# Altium schematic sheet MCU.SchDoc
size A4
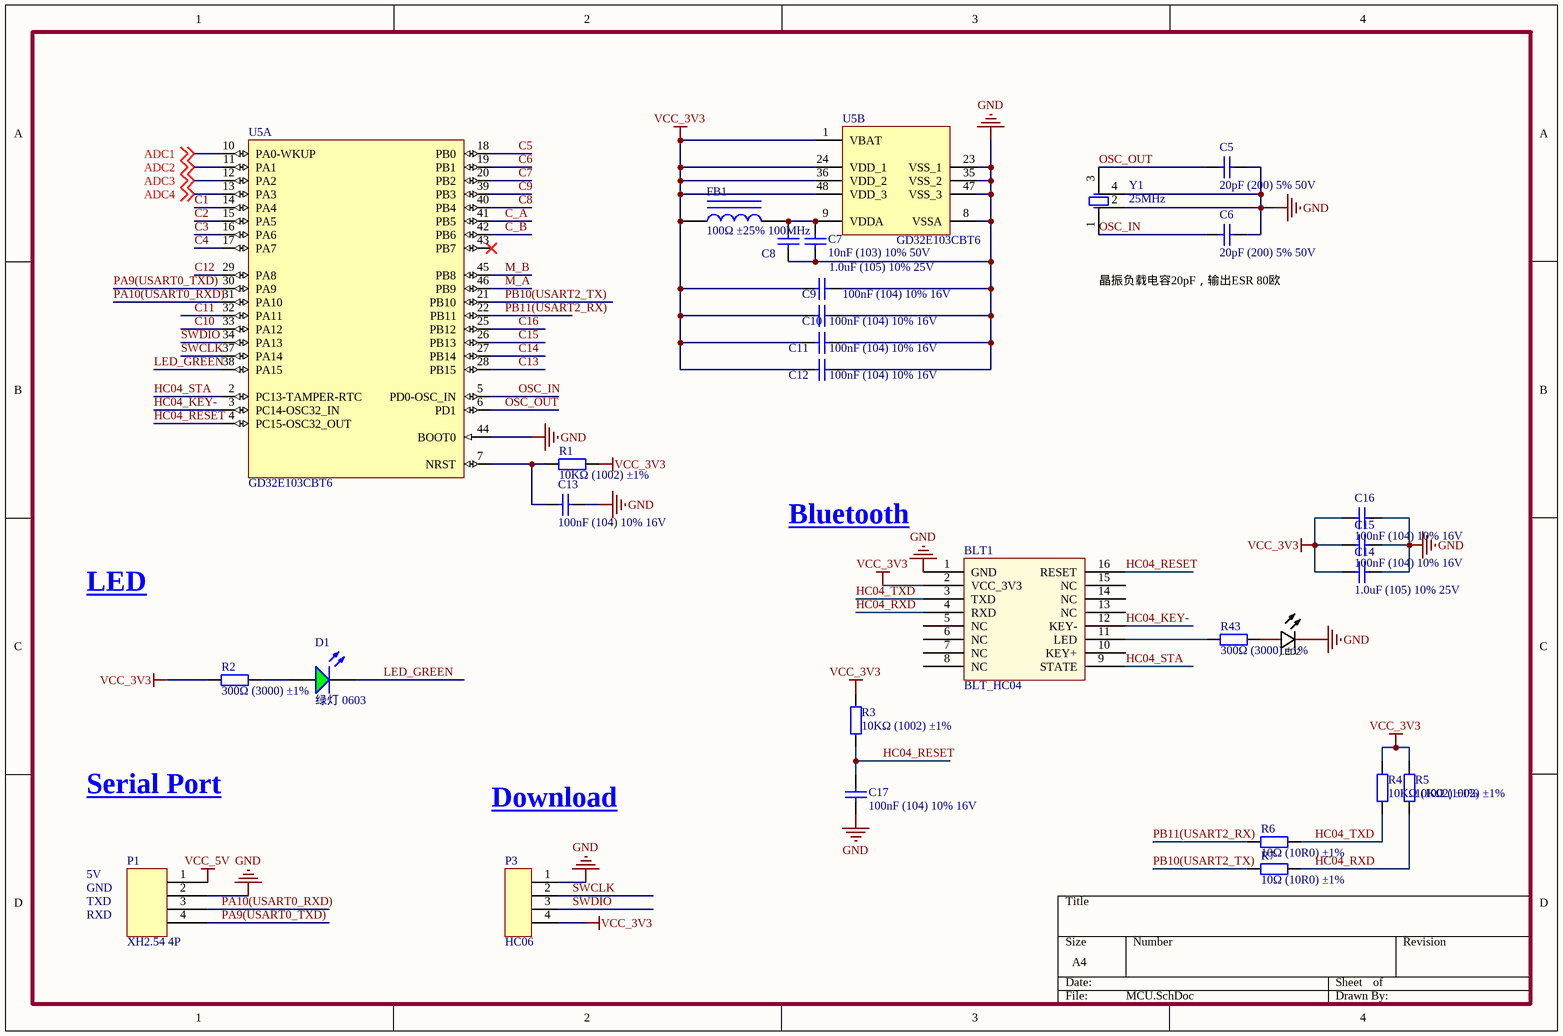
[diagram p0: MCU.SchDoc]

## Parts
BLT1  BLT_HC04  [HC04_BLT]
C5  20pF (200) 5% 50V  [0402_C]
C6  20pF (200) 5% 50V  [0402_C]
C7  10nF (103) 10% 50V  [0402_C]
C8  1.0uF (105) 10% 25V  [0402_C]
C9  100nF (104) 10% 16V  [0402_C]
C10  100nF (104) 10% 16V  [0402_C]
C11  100nF (104) 10% 16V  [0402_C]
C12  100nF (104) 10% 16V  [0402_C]
C13  100nF (104) 10% 16V  [0402_C]
C14  1.0uF (105) 10% 25V  [0402_C]
C15  100nF (104) 10% 16V  [0402_C]
C16  100nF (104) 10% 16V  [0402_C]
C17  100nF (104) 10% 16V  [0402_C]
D1  绿灯 0603  [0603_LED_S1]
FB1  100Ω ±25% 100MHz  [0805_L]
LED2  0603  [LED0603-RD]  (value not drawn)
P1  XH2.54 4P  [HC06]
P3  HC06  [HC06]
R1  10KΩ (1002) ±1%  [0402_R]
R2  300Ω (3000) ±1%  [0402_R]
R3  10KΩ (1002) ±1%  [0402_R]
R4  10KΩ (1002) ±1%  [0402_R]
R5  10KΩ (1002) ±1%  [0402_R]
R6  10Ω (10R0) ±1%  [0402_R]
R7  10Ω (10R0) ±1%  [0402_R]
R43  300Ω (3000) ±1%  [0402_R]
U5  GD32E103CBT6  [LQFP48_N]  (parts A,B of 2)
Y1  25MHz  [3225]

## Nets
GND: BLT1.1(GND) C5.2 C6.2 C7.1 C8.2 C9.2 C10.2 C11.2 C12.2 C13.2 C14.1 C15.1 C16.1 C17.1 LED2.2(K) P1.2 P3.1 U5.8(VSSA) U5.23(VSS_1) U5.35(VSS_2) U5.44(BOOT0) U5.47(VSS_3) Y1.2(HIN4) Y1.4(HIN4)
VCC_3V3: BLT1.2(VCC_3V3) C9.1 C10.1 C11.1 C12.1 C14.2 C15.2 C16.2 FB1.1 P3.4 R1.2 R2.1 R3.2 R4.2 R5.2 U5.1(VBAT) U5.24(VDD_1) U5.36(VDD_2) U5.48(VDD_3)
VCC_5V: P1.1
ADC1: U5.10(PA0-WKUP) ; off-sheet ADC1
ADC2: U5.11(PA1) ; off-sheet ADC2
ADC3: U5.12(PA2) ; off-sheet ADC3
ADC4: U5.13(PA3) ; off-sheet ADC4
C1: U5.14(PA4)
C2: U5.15(PA5)
C3: U5.16(PA6)
C4: U5.17(PA7)
C5: U5.18(PB0)
C6: U5.19(PB1)
C7: U5.20(PB2)
C8: U5.40(PB4)
C9: U5.39(PB3)
C10: U5.33(PA12)
C11: U5.32(PA11)
C12: U5.29(PA8)
C13: U5.28(PB15)
C14: U5.27(PB14)
C15: U5.26(PB13)
C16: U5.25(PB12)
C_A: U5.41(PB5)
C_B: U5.42(PB6)
HC04_KEY-: BLT1.12(KEY-) U5.3(PC14-OSC32_IN)
HC04_RESET: BLT1.16(RESET) C17.2 R3.1 U5.4(PC15-OSC32_OUT)
HC04_RXD: BLT1.4(RXD) R5.1 R7.2
HC04_STA: BLT1.9(STATE) U5.2(PC13-TAMPER-RTC)
HC04_TXD: BLT1.3(TXD) R4.1 R6.2
LED_GREEN: D1.K U5.38(PA15)
M_A: U5.46(PB9)
M_B: U5.45(PB8)
OSC_IN: C6.1 U5.5(PD0-OSC_IN) Y1.1(OSC2)
OSC_OUT: C5.1 U5.6(PD1) Y1.3(OSC1)
PA9(USART0_TXD): P1.4 U5.30(PA9)
PA10(USART0_RXD): P1.3 U5.31(PA10)
PB10(USART2_TX): R7.1 U5.21(PB10)
PB11(USART2_RX): R6.1 U5.22(PB11)
SWCLK: P3.2 U5.37(PA14)
SWDIO: P3.3 U5.34(PA13)
NetBLT1_11: BLT1.11(LED) R43.2
NetC7_2: C7.2 C8.1 FB1.2 U5.9(VDDA)
NetC13_1: C13.1 R1.1 U5.7(NRST)
NetD1_A: D1.A R2.2
NetLED2_1: LED2.1(A) R43.1

Not connected (* = marked no-connect by the designer): BLT1 5(NC) 6(NC) 7(NC) 8(NC) 10(KEY+) 13(NC) 14(NC) 15(NC); U5 43(PB7)*

## Notes on the sheet
- (near C6) 晶振负载电容20pF，输出ESR 80欧
- Bluetooth
- LED
- Serial Port
- Download
- 5V
- GND
- TXD
- RXD

## Library data of the parts
C5 C6 = 0402 20pF (200) 5% 50V: 贴片电容; ComponentLink1Description: 供应商链接; ComponentLink1URL: http://www.szlcsc.com/product/details_1906.html; Package: 0402; Supplier: LC; SuppliersPartNumber: C1554
C7 = 0402 10nF (103) 10% 50V: 贴片电容; ComponentLink1Description: 供应商链接; ComponentLink1URL: http://www.szlcsc.com/product/details_15869.html; Package: 0402; Supplier: LC; SuppliersPartNumber: C15195
C8-C12 = 0402-C: 贴片电容
C13 C15-C17 = 0402 100nF (104) 10% 16V: 贴片电容; ComponentLink1Description: 供应商链接; ComponentLink1URL: http://www.szlcsc.com/product/details_1877.html; Package: 0402; Supplier: LC; SuppliersPartNumber: C1525
C14 = 0402 1.0uF (105) 10% 25V: 贴片电容; ComponentLink1Description: 供应商链接; ComponentLink1URL: http://www.szlcsc.com/product/details_53938.html; Package: 0402; Supplier: LC; SuppliersPartNumber: C52923
D1 = 0603 绿灯: 发光二极管; ComponentLink1Description: 供应商链接; ComponentLink1URL: http://www.szlcsc.com/product/details_73152.html; Package: 0603; Supplier: LC; SuppliersPartNumber: C72043
FB1 = 0805 100Ω 25% 100MHz: 贴片磁珠; ComponentLink1Description: 供应商链接; ComponentLink1URL: http://www.szlcsc.com/product/details_1367.html; Package: 0805; Supplier: LC; SuppliersPartNumber: C1015
LED2 = 0603 LED 蓝: Manufacturer: 国星光电; Name: NCD0603B4; Symbol: FC-F1608BK-470H5; Add into BOM: yes; Emitted Color: 蓝灯; Device: NCD0603B4; LCSC Part Name: 蓝灯; Supplier Part: C89814; Manufacturer Part: NCD0603B4; Supplier Footprint: 0603; JLCPCB Part Class: Extended Part; Datasheet: https://atta.szlcsc.com/upload/public/pdf/source/20200820/C89814_3D11357C976AB31B19046E836063F91D.pdf; Supplier: LCSC; Convert to PCB: yes
R1 R3-R5 = 0402 10KΩ (1002) 1%: 贴片电阻; ComponentLink1Description: 供应商链接; ComponentLink1URL: http://www.szlcsc.com/product/details_26487.html; Package: 0402; Supplier: LC; SuppliersPartNumber: C25744
R2 R43 = 0402 300Ω (3000) 1%: 贴片电阻; ComponentLink1Description: 供应商链接; ComponentLink1URL: http://www.szlcsc.com/product/details_25845.html; Package: 0402; Supplier: LC; SuppliersPartNumber: C25102
R6 R7 = 0402 10Ω (10R0) 1%: 贴片电阻; ComponentLink1Description: 供应商链接; ComponentLink1URL: http://www.szlcsc.com/product/details_25820.html; Package: 0402; Supplier: LC; SuppliersPartNumber: C25077
Y1 = XTAL-4: Crystal Oscillator; Published: 8-Jun-2000; LatestRevisionDate: 17-Jul-2002; LatestRevisionNote: Re-released for DXP Platform.; PackageReference: R38; Publisher: Altium Limited; PackageDescription: Crystal, Thru-Hole; 2 Leads; Body 3.1 x 8.2 mm (Dia.xH)
U5 = GD32E103CBT6: DatasheetVersion: rev13.0, Apr-2011; PackageVersion: rev13, Apr-2011; PackageReference: LQFP48; PackageDescription: 48-Pin Low-Profile Quad Flat Pack, 7 x 7 mm Body, 0.5 mm Pitch (LQFP48); ComponentLink1Description: Manufacturer URL; ComponentLink1URL: http://www.st.com/; ComponentLink2Description: STM32F103 Datasheet; ComponentLink2URL: http://www.st.com/internet/com/TECHNICAL_RESOURCES/TECHNICAL_LITERATURE/DATASHEET/CD00161566.pdf; ComponentLink3Description: STM32 Family Web Page; ComponentLink3URL: www.st.com/stm32